# EAGLE schematic Esquematico_MINILAB_v3 v9 (EAGLE 9.7.0)
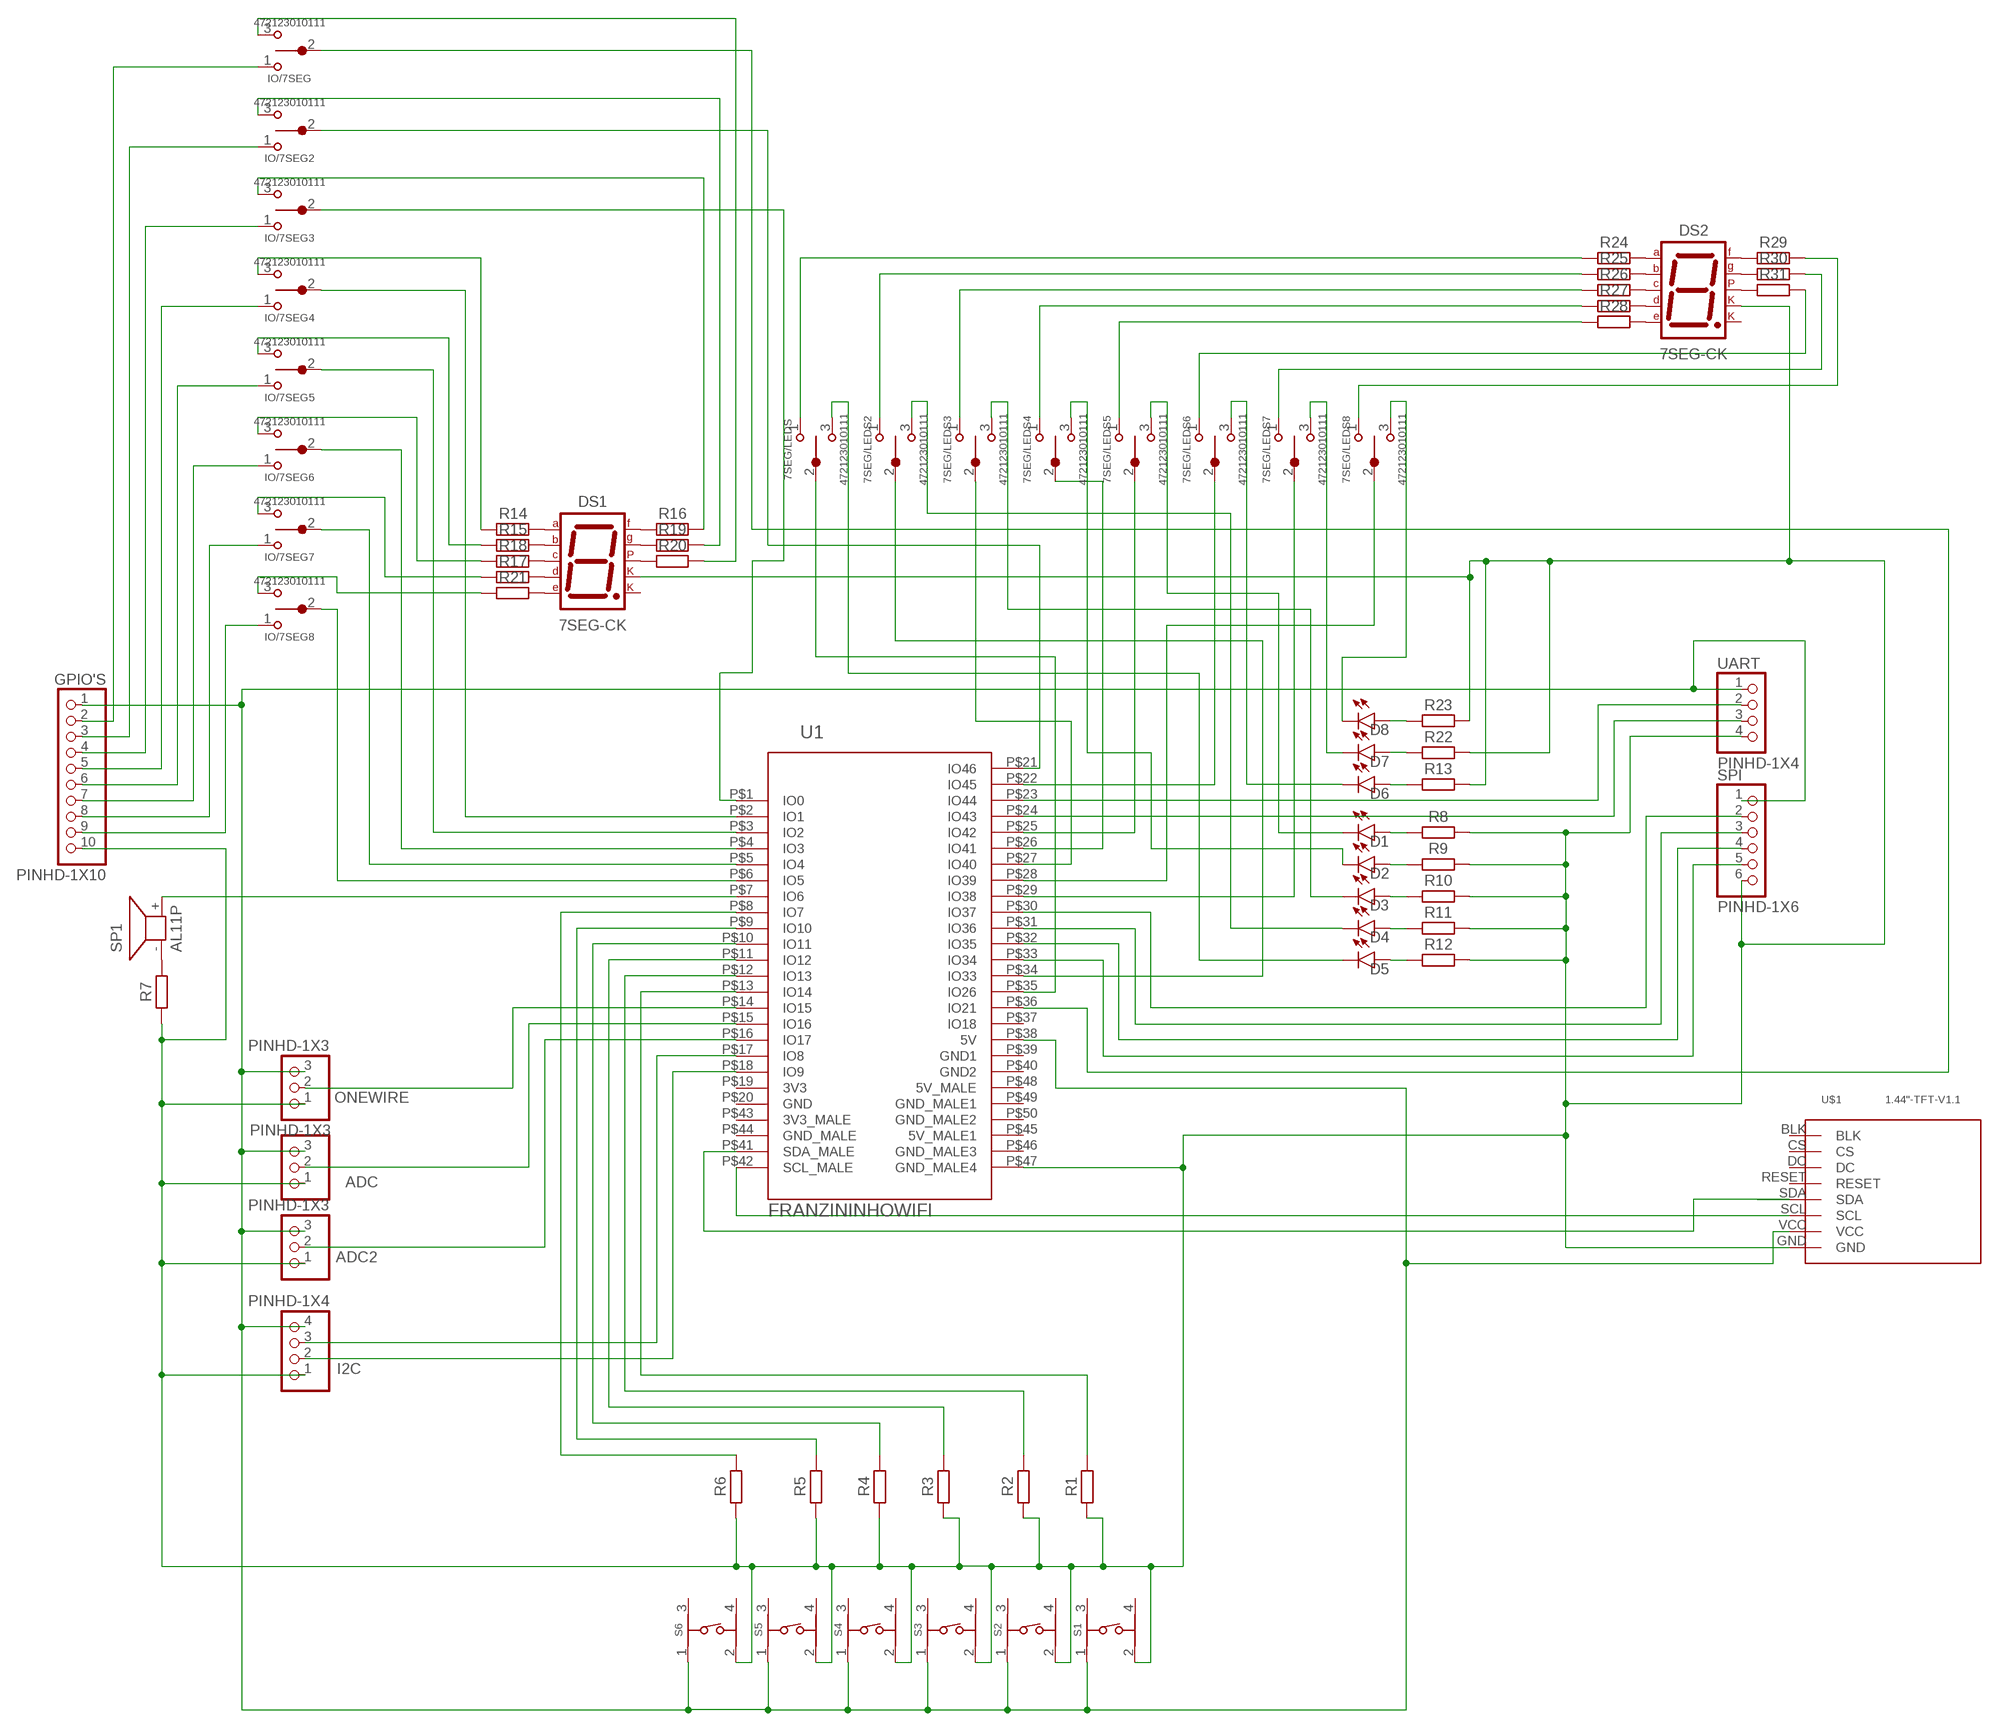
[diagram p0: schematic, sheet 1]

## Parts
7SEG/LEDS  472123010111  [472123010111]
7SEG/LEDS2  472123010111  [472123010111]
7SEG/LEDS3  472123010111  [472123010111]
7SEG/LEDS4  472123010111  [472123010111]
7SEG/LEDS5  472123010111  [472123010111]
7SEG/LEDS6  472123010111  [472123010111]
7SEG/LEDS7  472123010111  [472123010111]
7SEG/LEDS8  472123010111  [472123010111]
ADC  PINHD-1X3  [1X03]
ADC2  PINHD-1X3  [1X03]
D1  LED_RED  LED_RADIAL_RED  [LEDRD254W60D565H860B]
D2  LED_RED  LED_RADIAL_RED  [LEDRD254W60D565H860B]
D3  LED_RED  LED_RADIAL_RED  [LEDRD254W60D565H860B]
D4  LED_RED  LED_RADIAL_RED  [LEDRD254W60D565H860B]
D5  LED_RED  LED_RADIAL_RED  [LEDRD254W60D565H860B]
D6  LED_RED  LED_RADIAL_RED  [LEDRD254W60D565H860B]
D7  LED_RED  LED_RADIAL_RED  [LEDRD254W60D565H860B]
D8  LED_RED  LED_RADIAL_RED  [LEDRD254W60D565H860B]
DS1  7SEG-CK  [7SEG-13]
DS2  7SEG-CK  [7SEG-13]
GPIO'S  PINHD-1X10  [1X10]
I2C  PINHD-1X4  [1X04]
IO/7SEG  472123010111  [472123010111]
IO/7SEG2  472123010111  [472123010111]
IO/7SEG3  472123010111  [472123010111]
IO/7SEG4  472123010111  [472123010111]
IO/7SEG5  472123010111  [472123010111]
IO/7SEG6  472123010111  [472123010111]
IO/7SEG7  472123010111  [472123010111]
IO/7SEG8  472123010111  [472123010111]
ONEWIRE  PINHD-1X3  [1X03]
R1  R_AXIAL-11.7MM-PITCH  [RESAD1176W63L850D250B]
R2  R_AXIAL-11.7MM-PITCH  [RESAD1176W63L850D250B]
R3  R_AXIAL-11.7MM-PITCH  [RESAD1176W63L850D250B]
R4  R_AXIAL-11.7MM-PITCH  [RESAD1176W63L850D250B]
R5  R_AXIAL-11.7MM-PITCH  [RESAD1176W63L850D250B]
R6  R_AXIAL-11.7MM-PITCH  [RESAD1176W63L850D250B]
R7  R_AXIAL-11.7MM-PITCH  [RESAD1176W63L850D250B]
R8  R_AXIAL-11.7MM-PITCH  [RESAD1176W63L850D250B]
R9  R_AXIAL-11.7MM-PITCH  [RESAD1176W63L850D250B]
R10  R_AXIAL-11.7MM-PITCH  [RESAD1176W63L850D250B]
R11  R_AXIAL-11.7MM-PITCH  [RESAD1176W63L850D250B]
R12  R_AXIAL-11.7MM-PITCH  [RESAD1176W63L850D250B]
R13  R_AXIAL-11.7MM-PITCH  [RESAD1176W63L850D250B]
R14  R_AXIAL-11.7MM-PITCH  [RESAD1176W63L850D250B]
R15  R_AXIAL-11.7MM-PITCH  [RESAD1176W63L850D250B]
R16  R_AXIAL-11.7MM-PITCH  [RESAD1176W63L850D250B]
R17  R_AXIAL-11.7MM-PITCH  [RESAD1176W63L850D250B]
R18  R_AXIAL-11.7MM-PITCH  [RESAD1176W63L850D250B]
R19  R_AXIAL-11.7MM-PITCH  [RESAD1176W63L850D250B]
R20  R_AXIAL-11.7MM-PITCH  [RESAD1176W63L850D250B]
R21  R_AXIAL-11.7MM-PITCH  [RESAD1176W63L850D250B]
R22  R_AXIAL-11.7MM-PITCH  [RESAD1176W63L850D250B]
R23  R_AXIAL-11.7MM-PITCH  [RESAD1176W63L850D250B]
R24  R_AXIAL-11.7MM-PITCH  [RESAD1176W63L850D250B]
R25  R_AXIAL-11.7MM-PITCH  [RESAD1176W63L850D250B]
R26  R_AXIAL-11.7MM-PITCH  [RESAD1176W63L850D250B]
R27  R_AXIAL-11.7MM-PITCH  [RESAD1176W63L850D250B]
R28  R_AXIAL-11.7MM-PITCH  [RESAD1176W63L850D250B]
R29  R_AXIAL-11.7MM-PITCH  [RESAD1176W63L850D250B]
R30  R_AXIAL-11.7MM-PITCH  [RESAD1176W63L850D250B]
R31  R_AXIAL-11.7MM-PITCH  [RESAD1176W63L850D250B]
S1  430156050726  [4301X60507X6]
S2  430156050726  [4301X60507X6]
S3  430156050726  [4301X60507X6]
S4  430156050726  [4301X60507X6]
S5  430156050726  [4301X60507X6]
S6  430156050726  [4301X60507X6]
SP1  AL11P  [AL11P]
SPI  PINHD-1X6  [1X06]
U1  FRANZININHOWIFI  [FOOTPRINT-FRANZININHO]
U$1  1.44"-TFT-V1.1  [1.44-TFT-V1.1]
UART  PINHD-1X4  [1X04]

## Nets
N$1: R7.2 SP1.-
N$2: ADC2.1 ADC.1 DS1.3(CK1) DS2.3(CK1) GPIO'S.10 I2C.1 ONEWIRE.1 R1.1 R2.1 R3.1 R4.1 R5.1 R6.1 R7.1 R8.2 R9.2 R10.2 R11.2 R12.2 R13.2 R22.2 R23.2 S1.2 S2.2 S3.2 S4.2 S5.2 S6.2 SPI.6 U1.P$47(GND_MALE4) U$1.GND UART.4
N$3: R6.2 U1.P$8(IO7)
N$4: 7SEG/LEDS4.2 U1.P$26(IO41)
N$5: 7SEG/LEDS3.2 U1.P$27(IO40)
N$6: R5.2 U1.P$9(IO10)
N$7: 7SEG/LEDS.2 U1.P$35(IO26)
N$8: 7SEG/LEDS2.2 U1.P$34(IO33)
N$9: 7SEG/LEDS6.2 U1.P$22(IO45)
N$10: R4.2 U1.P$10(IO11)
N$11: R3.2 U1.P$11(IO12)
N$12: R2.2 U1.P$12(IO13)
N$13: R1.2 U1.P$13(IO14)
N$14: U1.P$41(SDA_MALE) U$1.SDA
N$15: I2C.3 U1.P$17(IO8)
N$16: ADC2.2 U1.P$16(IO17)
N$17: 7SEG/LEDS5.2 U1.P$25(IO42)
N$18: D1.1(A) R8.1
N$19: D2.1(A) R9.1
N$20: D3.1(A) R10.1
N$21: D4.1(A) R11.1
N$22: D5.1(A) R12.1
N$23: D6.1(A) R13.1
N$24: I2C.2 U1.P$18(IO9)
N$25: U1.P$24(IO43) UART.3
N$26: U1.P$23(IO44) UART.2
N$27: SPI.2 U1.P$30(IO37)
N$28: SPI.3 U1.P$31(IO36)
N$29: SPI.4 U1.P$32(IO35)
N$30: SPI.5 U1.P$33(IO34)
N$31: D8.1(A) R23.1
N$32: ADC.2 U1.P$15(IO16)
N$33: ONEWIRE.2 U1.P$14(IO15)
N$34: SP1.+ U1.P$7(IO6)
N$35: DS1.7(A) R14.2
N$36: IO/7SEG8.2 U1.P$6(IO5)
N$37: IO/7SEG7.2 U1.P$5(IO4)
N$38: DS1.6(B) R15.2
N$39: IO/7SEG3.2 U1.P$1(IO0)
N$40: IO/7SEG6.2 U1.P$4(IO3)
N$41: IO/7SEG5.2 U1.P$3(IO2)
N$42: DS1.4(C) R17.2
N$43: DS1.2(D) R18.2
N$44: DS1.1(E) R21.2
N$45: IO/7SEG4.2 U1.P$2(IO1)
N$46: DS1.9(F) R16.1
N$47: DS1.10(G) R19.1
N$48: IO/7SEG2.2 U1.P$21(IO46)
N$49: DS1.5(DP) R20.1
N$50: IO/7SEG.2 U1.P$36(IO21)
N$51: ADC2.3 ADC.3 GPIO'S.1 I2C.4 ONEWIRE.3 S1.1 S2.1 S3.1 S4.1 S5.1 S6.1 SPI.1 U1.P$38(5V) U$1.VCC UART.1
N$52: D7.1(A) R22.1
N$53: 7SEG/LEDS7.2 U1.P$29(IO38)
N$54: 7SEG/LEDS8.2 U1.P$28(IO39)
N$55: 7SEG/LEDS8.3 D8.2(C)
N$56: DS2.2(D) R27.2
N$57: DS2.4(C) R26.2
N$58: DS2.6(B) R25.2
N$59: DS2.7(A) R24.2
N$60: DS2.1(E) R28.2
N$61: DS2.9(F) R29.1
N$62: DS2.10(G) R30.1
N$63: DS2.5(DP) R31.1
N$64: 7SEG/LEDS.1 R24.1
N$65: 7SEG/LEDS2.1 R25.1
N$66: 7SEG/LEDS3.1 R26.1
N$67: 7SEG/LEDS4.1 R27.1
N$68: 7SEG/LEDS5.1 R28.1
N$69: 7SEG/LEDS6.1 R31.2
N$70: 7SEG/LEDS7.1 R30.2
N$71: 7SEG/LEDS8.1 R29.2
N$72: 7SEG/LEDS7.3 D7.2(C)
N$73: 7SEG/LEDS6.3 D6.2(C)
N$75: 7SEG/LEDS5.3 D1.2(C)
N$76: 7SEG/LEDS4.3 D2.2(C)
N$77: 7SEG/LEDS3.3 D3.2(C)
N$78: 7SEG/LEDS2.3 D4.2(C)
N$79: 7SEG/LEDS.3 D5.2(C)
N$80: IO/7SEG7.3 R18.1
N$81: IO/7SEG6.3 R17.1
N$82: IO/7SEG5.3 R15.1
N$83: IO/7SEG4.3 R14.1
N$84: IO/7SEG8.3 R21.1
N$85: GPIO'S.9 IO/7SEG8.1
N$86: GPIO'S.8 IO/7SEG7.1
N$87: GPIO'S.7 IO/7SEG6.1
N$88: GPIO'S.6 IO/7SEG5.1
N$89: GPIO'S.5 IO/7SEG4.1
N$90: IO/7SEG3.3 R16.2
N$91: IO/7SEG2.3 R19.2
N$92: IO/7SEG.3 R20.2
N$93: GPIO'S.4 IO/7SEG3.1
N$94: GPIO'S.3 IO/7SEG2.1
N$95: GPIO'S.2 IO/7SEG.1
N$96: U1.P$42(SCL_MALE) U$1.SCL
Unconnected: DS1.8(CK2) DS2.8(CK2) S1.3 S1.4 S2.3 S2.4 S3.3 S3.4 S4.3 S4.4 S5.3 S5.4 S6.3 S6.4 U1.P$37(IO18) U$1.BLK U$1.CS U$1.DC U$1.RESET

## Power pins joined to a net without a drawn wire
3V3: U1.P$19(3V3)
3V3_MALE: U1.P$43(3V3_MALE)
5V_MALE: U1.P$48(5V_MALE)
5V_MALE1: U1.P$45(5V_MALE1)
GND: U1.P$20(GND)
GND1: U1.P$39(GND1)
GND2: U1.P$40(GND2)
GND_MALE: U1.P$44(GND_MALE)
GND_MALE1: U1.P$49(GND_MALE1)
GND_MALE2: U1.P$50(GND_MALE2)
GND_MALE3: U1.P$46(GND_MALE3)

## Library data of the parts
7SEG/LEDS 7SEG/LEDS2-7SEG/LEDS8 IO/7SEG IO/7SEG2-IO/7SEG8 = Wurth_Switch_WS-TOTV:472123010111: WS-TOTV Ø 6.35mm Panel Cut-Out Vertical Operation Toggle Switch Material Properties Actuator Material Copper Alloy Cover Material Stainless Steel Frame Material DAP Frame Flammability Rating UL94 V-0 Moveable Contact Material Copper Alloy Moveable Contact Plating Silver Stationary Contact Material Copper Alloy Stationary Contact Plating Silver Terminal Material Copper Alloy Terminal Plating Silver Electrical Properties IR 1 A VR 30 V (DC) Contact Resistance Initial 30 mΩ RISO 1000 MΩ Withstanding Voltage 500 V (AC) Mechanical Properties Electrical Life 50000 Steps Connection Type Opposite Side Connection General Information Operating Temperature -40 up to +85 °C <https://www.we-online.com/catalog/media/o718996v209%20family-totv-4721xx0x0xxx.jpg> Details see: www.we-online.com/catalog/WS-TOTV_635_CUT_OUT_VERT_OPERATION <www.we-online.com/catalog/WS-TOTV_635_CUT_OUT_VERT_OPERATION/?utm_source=eagle_model&utm_medium=description_link&utm_campaign=eisos_eagle> Updated by Ella Wu 2022-11-11 2022(C) Würth Elektronik; ACTUATOR-LENGTH: 10.7mm; BUSHING-LENGTH: 9mm; DATASHEET-URL: https://www.we-online.com/redexpert/spec/472123010111?ae; MOUNT: THT; PART-NUMBER: 472123010111; SWITCHING-FUNCTION: ON-OFF-ON
ADC ADC2 ONEWIRE = Connector:PINHD-1X3: PIN HEADER; CATEGORY: CONNECTOR; SUB-CATEGORY: PIN-HEADER
D1-D8 = Opto-Electronic:LED_RADIAL: LED - Generic; CATEGORY: Opto-Electronic; SUB-CATEGORY: LED
DS1 DS2 = Opto-Electronic:7SEG-CK: 7-segment DISPLAY single cathode, 13 mm; CATEGORY: Opto-Electronic; SUB-CATEGORY: Display; TYPE: 7-Segment
GPIO'S = Connector:PINHD-1X10: PIN HEADER; CATEGORY: CONNECTOR; SUB-CATEGORY: PIN-HEADER
I2C UART = Connector:PINHD-1X4: PIN HEADER; CATEGORY: CONNECTOR; SUB-CATEGORY: PIN-HEADER
R1-R31 = Resistor:R: Resistor Fixed - Generic; CATEGORY: Resistor; SUB-CATEGORY: Fixed
S1-S6 = Wurth_Switch_WS-TATV:430156050726: WS-TATV THT Tact Switch 6x6 mm Material Properties Cover Material : Stainless Steel Properties Actuator Material:LCP Actuator Flammability Rating:UL94 V-0 Actuator Color:Black; Salmon; White Frame Material:PPA Frame Flammability Rating:UL94 HB Frame Color:Black Contact Material:Stainless Steel Contact Plating:Silver Terminal Material:Copper Alloy Terminal Plating:Silver VR:12 V (DC) Contact Resistance Initial:100 mΩ Contact Resistance After Life Test:2 Ω RISO:100 MΩ Withstanding Voltage:250 V (AC) Washable:No Qty.:200 Mechanical Properties Stroke 0.25 mm General Information Operating Temperature:-40 up to +85 °C Washable:No Packaging Properties Packaging:Bulk <https://www.we-online.com/catalog/media/o61106v209%20Family_WS_TST_THT_4301x6xxx7x6_pf2.jpg> Details see: https://www.we-online.com/catalog/en/TATV_6X6_THT_4301x6xxx7x6/ Updated by yingchun,Shan;2020-02-21 2020(C) Würth Elektronik; DATASHEET-URL: https://www.we-online.com/catalog/datasheet/430156050726.pdf; H: 5.0mm; OPERATION-FORCE: 260g; PART-NUMBER: 430156050726; QTY: 200
SP1 = buzzer:AL11P: SPEAKER Source: Buerklin; OC_FARNELL: unknown; OC_NEWARK: unknown
SPI = Connector:PINHD-1X6: PIN HEADER; CATEGORY: CONNECTOR; SUB-CATEGORY: PIN-HEADER
U1 = Biblioteca Franzininho:FRANZININHO: Check availability <https://pricing.snapeda.com/parts/ESP32-S2-WROOM/Espressif%20Systems/view-part?ref=eda> Check availability <https://pricing.snapeda.com/parts/ESP32-S2-WROOM/Espressif%20Systems/view-part?ref=eda> Check availability <https://pricing.snapeda.com/parts/ESP32-S2-WROOM/Espressif%20Systems/view-part?ref=eda>
U$1 = Biblioteca LCD:1.44"-TFT-V1.1